# Altium schematic sheet dv_analog_interface.SchDoc
size 297 x 420 mm
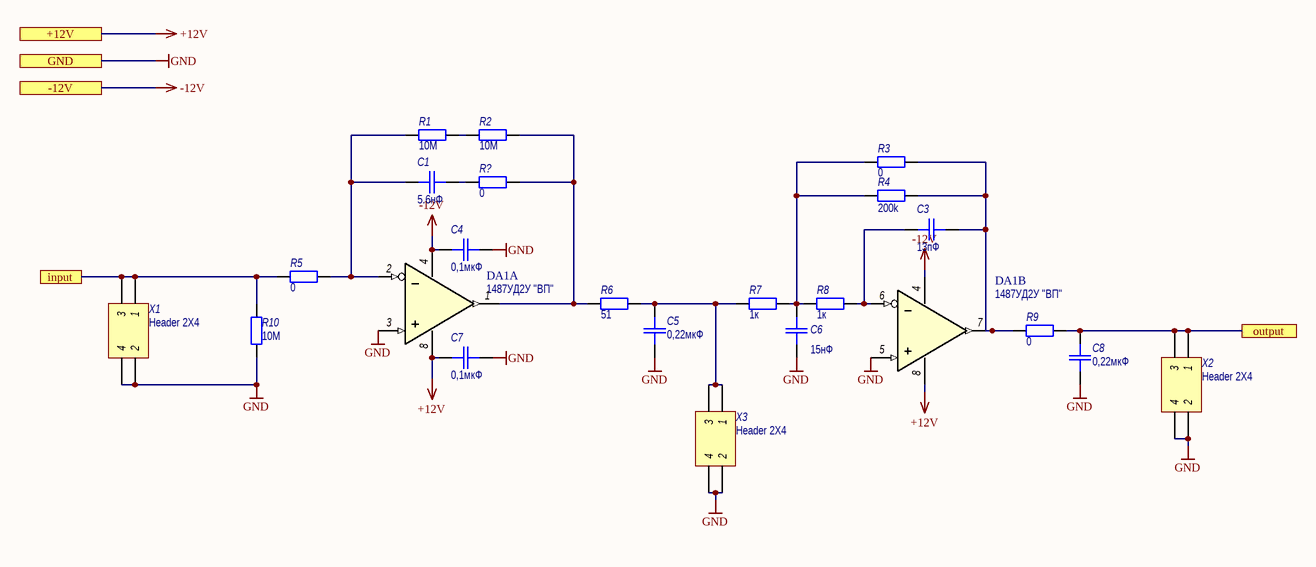
[diagram p0: dv_analog_interface.SchDoc]

## Parts
C1  5.6нФ  [SMD_0805]
C3  13пФ  [SMD_0805]
C4  0,1мкФ  [SMD_0805]
C5  0,22мкФ  [SMD_0805]
C6  15нФ  [SMD_0805]
C7  0,1мкФ  [SMD_0805]
C8  0,22мкФ  [SMD_0805]
DA1  Наименование: 1487УД2У "ВП"  [HO2.8-1B]  (hidden comment: 1487UD2U)  (parts A,B of 2)
R1  10M  [SMD_0805]
R2  10M  [SMD_0805]
R3  0  [SMD_0805]
R4  200k  [SMD_0805]
R5  0  [SMD_0805]
R6  51  [SMD_0805]
R7  1к  [SMD_0805]
R8  1к  [SMD_0805]
R9  0  [SMD_0805]
R10  10M  [SMD_0805]
R?  0  [SMD_0805]
X1  Header 2X4  [PBD-4]
X2  Header 2X4  [PBD-4]
X3  Header 2X4  [PBD-4]

## Ports
+12V, -12V, GND, input, output

## Nets
+12V: C7.1 DA1.8(Vss+) ; port +12V
-12V: C4.1 DA1.4(Vss-) ; port -12V
GND: C4.2 C5.1 C6.1 C7.2 C8.1 DA1.3(In+) DA1.5(In+) R10.1 X1.2 X1.4 X2.2 X2.4 X3.2 X3.4 ; port GND
input: R5.1 R10.2 X1.1 X1.3 ; port input
output: C8.2 R9.2 X2.1 X2.3 ; port output
NetC1_1: C1.1 DA1.2(In-) R1.1 R5.2
NetC1_2: C1.2 R?.1
NetC3_1: C3.1 DA1.7(Out) R3.2 R4.2 R9.1
NetC3_2: C3.2 DA1.6(In-) R8.2
NetC5_2: C5.2 R6.2 R7.1 X3.1 X3.3
NetC6_2: C6.2 R3.1 R4.1 R7.2 R8.1
NetDA1_1: DA1.1(Out) R2.2 R6.1 R?.2
NetR1_2: R1.2 R2.1

## Notes on the sheet
- Подп. и дата
- Инв. № дубл.
- Взам. инв. №
- Инв. № подл.
- Изм.
- Лист
- № докум.
- Подп.
- Дата
- Форма 2а ГОСТ 2.104-2006
- Копировал
- Формат А3

## Library data of the parts
C1 C3-C8 = Capacitor: Назначение: SMD-конденсатор; Наименование: Конденсатор; Потребление, Вт: 0
  C1: Value: 5.6нФ
  C3: Value: 13пФ
  C4 C7: Value: 0,1мкФ
  C5 C8: Value: 0,22мкФ
  C6: Value: 15нФ
DA1 = 1487UD2U: Сдвоенный операционный усилитель; Потребление, Вт: 0,01; Назначение: Сдвоенный операционный усилитель
R1-R10 R? = Resistor: Наименование: Резистор; Назначение: SMD-резистор; Потребление, Вт: 0,001
  R1 R2 R10: Value: 10M
  R3 R5 R9 R?: Value: 0
  R4: Value: 200k
  R6: Value: 51
  R7 R8: Value: 1к
X1-X3 = Header 2X4: Header, 4-Pin, Dual row; Потребление, Вт: 0,0; Назначение: Header, 4-Pin, Dual row; Наименование: Header 2X4